# Altium schematic sheet 1A18J4_1A20J18 B.SchDoc: Cable Assembly
size A; Date: 1/1/17; CompanyName: National Center for Atmospheric Research; DrawnBy: Rich Erickson; Engineer: 4/21/17; Organization: Earth Observing Laboratory; Address1: 3450 Mitchell Lane; Address2: FL1; Address3: 3090 Center Green Dr.; Address4: Boulder, CO. 80301; DocumentNumber: 1A18J4_1A20J18(Door Interlock, PWR Reset); Revision: B; SheetNumber: 1; SheetTotal: 1; Department: Remote Sensing Facility; PageSetup: Record=PageOptions|CenterHorizontal=True|CenterVertical=True|PrintScale=1.07|XCorrection=1.00|YCorrection=1.00|PrintKind=1|BorderSize=5000000|LeftOffset=0|BottomOffset=0|Orientation=2|PaperLength=1000|PaperWidth=1000|Scale=100|PaperSource=273|PrintQuality=600|MediaType=1|DitherType=10|PrintScaleMode=1|PaperKind=Letter|PaperIndex=1; ModifiedDate: 7/17/97; ImagePath: 4/21/17; ProjectName: Ka Band; Application_BuildNumber: 5
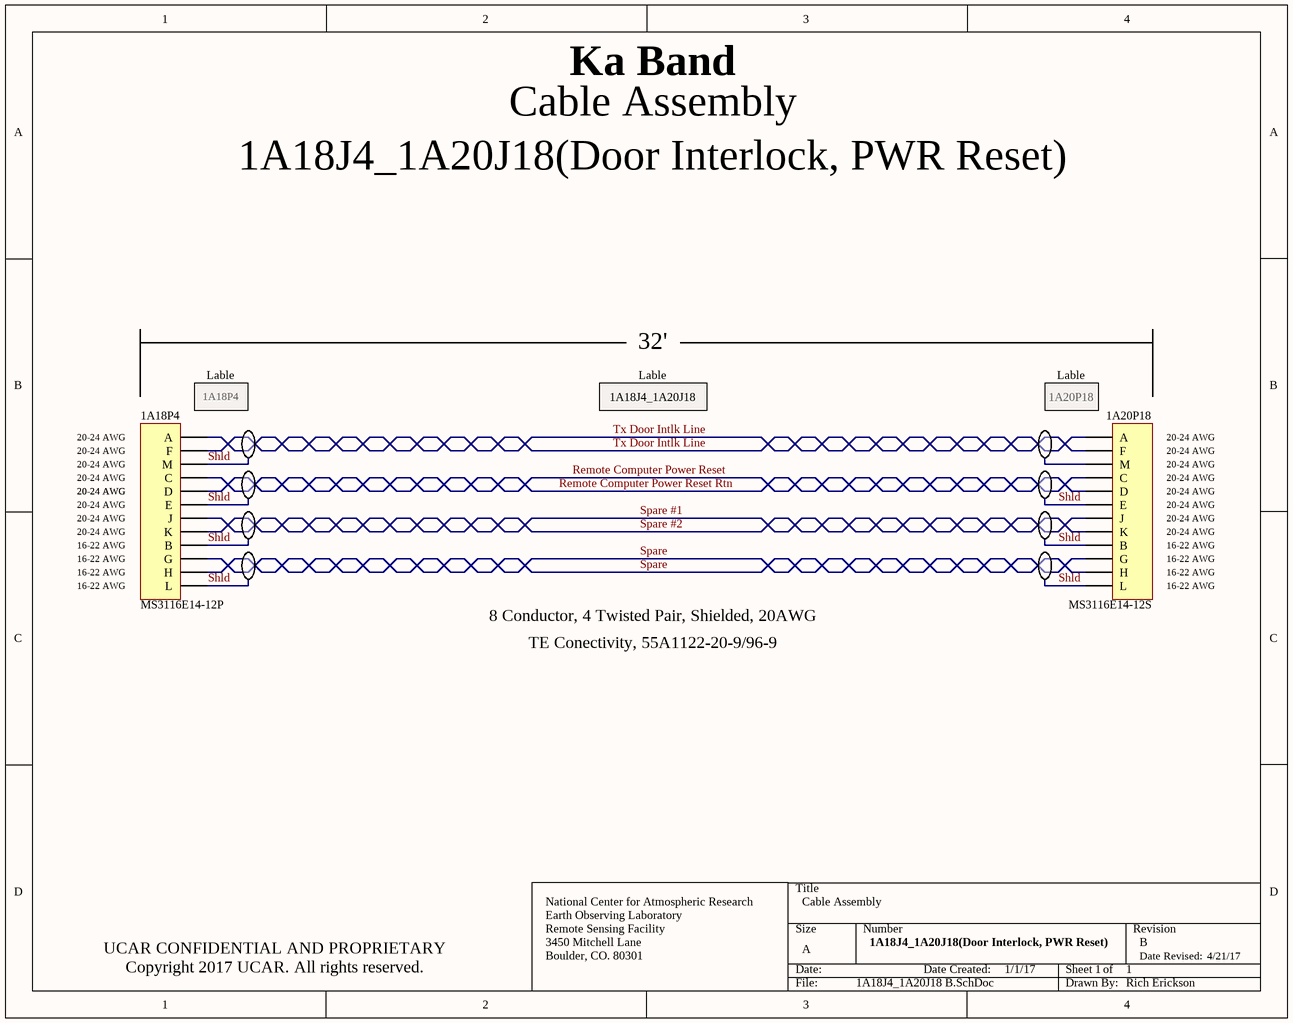
[diagram p0: 1A18J4_1A20J18 B.SchDoc]

## Parts
1A18P4  MS3116E14-12P  [HDR1X12]
1A20P18  MS3116E14-12S  [HDR1X12]

## Nets
Remote Computer Power Reset: 1A18P4.4(C) 1A20P18.4(C)
Remote Computer Power Reset Rtn: 1A18P4.5(D) 1A20P18.5(D)
Shld: 1A18P4.3(M) 1A18P4.6(E) 1A18P4.9(B) 1A18P4.12(L) 1A20P18.6(E) 1A20P18.9(B) 1A20P18.12(L)
Spare: 1A18P4.10(G) 1A18P4.11(H) 1A20P18.10(G) 1A20P18.11(H)
Spare #1: 1A18P4.7(J) 1A20P18.7(J)
Spare #2: 1A18P4.8(K) 1A20P18.8(K)
Tx Door Intlk Line: 1A18P4.1(A) 1A18P4.2(F) 1A20P18.1(A) 1A20P18.2(F)

Not connected (* = marked no-connect by the designer): 1A20P18 3(M)

## Notes on the sheet
- 32'
- 20-24 AWG
- (near 1A18P4) 1A18P4
- Lable
- 1A18J4_1A20J18
- (near 1A20P18) 1A20P18
- 16-22 AWG
- 8 Conductor, 4 Twisted Pair, Shielded, 20AWG
- TE Conectivity, 55A1122-20-9/96-9
- UCAR CONFIDENTIAL AND PROPRIETARY
  Copyright 2017 UCAR. All rights reserved.
- Date Created:
- Date Revised:

## Library data of the parts
1A18P4 1A20P18 = Header 12: Header, 12-Pin; LatestRevisionDate: 17-Jul-2002; LatestRevisionNote: Re-released for DXP Platform.; Publisher: Altium Limited